# EAGLE design Pi2c (EAGLE 6.3)
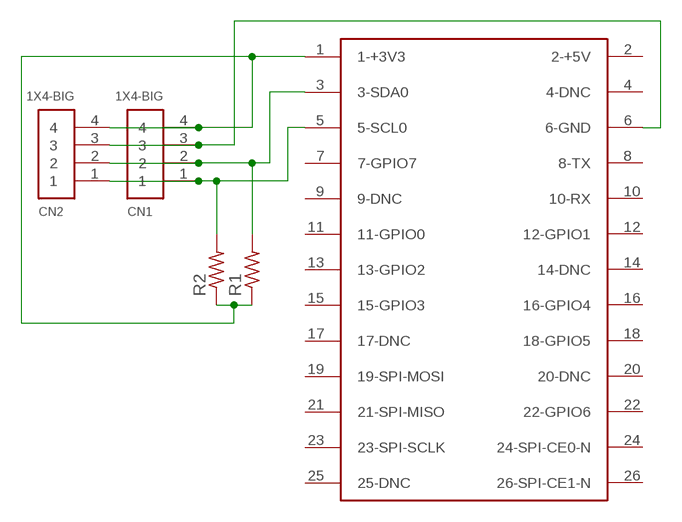
[diagram p0: schematic, sheet 1]

## Parts
CN1  1X4-BIG  [1X04-BIG]
CN2  1X4-BIG  [1X04-BIG]
R1  R-US_0207/7  [0207/7]
R2  R-US_0207/7  [0207/7]
U$1  RASPBERRY-PI  [RASPBERRY-PI]

## Nets
N$1: CN1.4 CN2.4 R1.1 R2.1 U$1.1(1-+3V3)
N$2: CN1.3 CN2.3 U$1.6(6-GND)
N$3: CN1.2 CN2.2 R1.2 U$1.3(3-SDA0)
N$4: CN1.1 CN2.1 R2.2 U$1.5(5-SCL0)
Unconnected: U$1.2(2-+5V) U$1.4(4-DNC) U$1.7(7-GPIO7) U$1.8(8-TX) U$1.9(9-DNC) U$1.10(10-RX) U$1.11(11-GPIO0) U$1.12(12-GPIO1) U$1.13(13-GPIO2) U$1.14(14-DNC) U$1.15(15-GPIO3) U$1.16(16-GPIO4) U$1.17(17-DNC) U$1.18(18-GPIO5) U$1.19(19-SPI-MOSI) U$1.20(20-DNC) U$1.21(21-SPI-MISO) U$1.22(22-GPIO6) U$1.23(23-SPI-SCLK) U$1.24(24-SPI-CE0-N) U$1.25(25-DNC) U$1.26(26-SPI-CE1-N)

## Library data of the parts
CN1 CN2 = adafruit_mod:1X4: 4-pin connector
R1 R2 = adafruit_mod:R-US_: RESISTOR, American symbol
U$1 = RaspberryPi:RASPBERRY-PI: Raspberry Pi Board <http://www.raspberrypi.org/> Jacques Lagnel V1.0 (beta) 2012 Board dimension: Forum 3D model <http://www.raspberrypi.org/forum/general-discussion/mechanical-profile-3d-models?value=3d%20model&type=1&include=1&search=1&ret=all> The GPIO Connector (P1): http://elinux.org/RPi_Low-level_peripherals

## Board
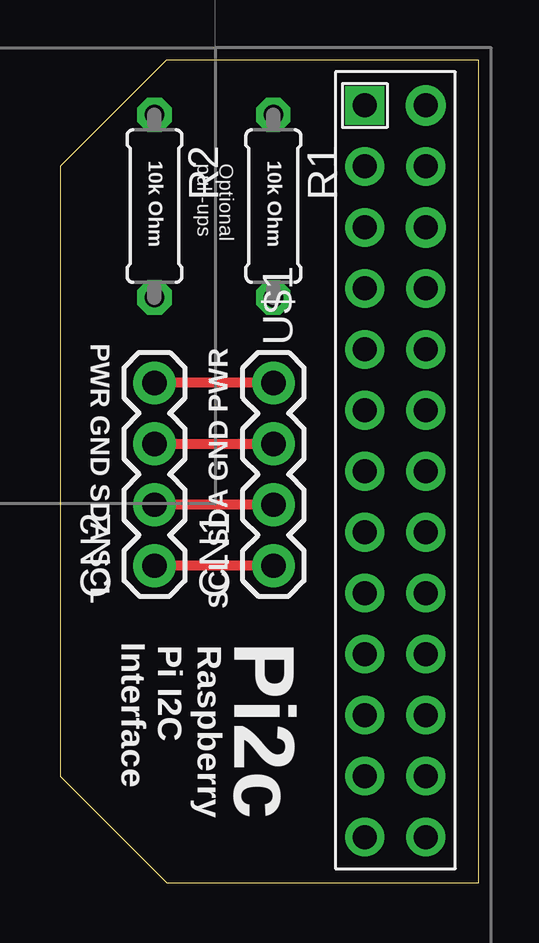
[diagram p1: board, top side]
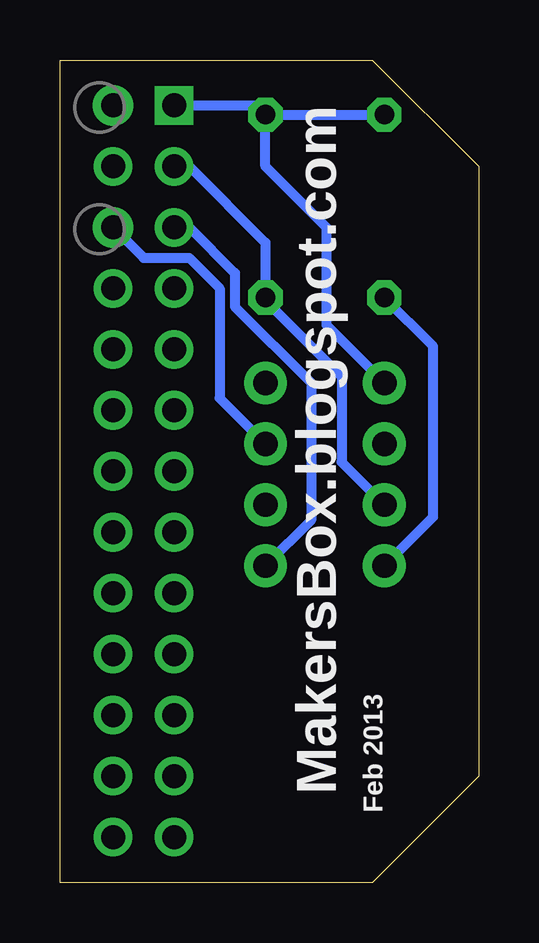
[diagram p2: board, bottom side, seen from below]

Size 17.45 x 34.28 mm. Coordinates in mm from the lower left corner, seen from the top.
Outline: 4.45,0 17.45,0 17.45,34.28 4.44,34.28 0,29.84 0,4.45 4.45,0
Copper layers (1*16): Top 0.035mm / dielectric 1.5mm / Bottom 0.035mm
Design rules "SparkFun": minimum track width 8mil, minimum drill 20mil, track to track 8mil, track to pad 8mil, pad to pad 8mil, via to via 8mil, smd to smd 8mil, copper to edge 10mil, drill to drill 8mil, minimum pad ring 12mil, minimum via ring 10mil, stop-mask expansion 4mil, vias tented up to drill 25mil, thermal gap 10mil

### Footprints (pad centres in the part's own frame; a part is rotated, then mirrored left to right if it is on the bottom)
1X04-BIG = drill 1.016 pad 1.778: 1 0,0; 2 2.54,0; 3 5.08,0; 4 7.62,0
0207/7 = drill 0.813 octagon: 1 -3.81,0; 2 3.81,0
RASPBERRY-PI = drill 1 square: 1 0,0 | drill 1 pad 1.676: 2 0,2.54; 6 5.08,2.54 | drill 1: 3 2.54,0; 4 2.54,2.54; 5 5.08,0; 7 7.62,0; 8 7.62,2.54; 9 10.16,0; 10 10.16,2.54; 11 12.7,0; 12 12.7,2.54; 13 15.24,0; 14 15.24,2.54; 15 17.78,0; 16 17.78,2.54; 17 20.32,0; 18 20.32,2.54; 19 22.86,0; 20 22.86,2.54; 21 25.4,0; 22 25.4,2.54; 23 27.94,0; 24 27.94,2.54; 25 30.48,0; 26 30.48,2.54

### Placement (x,y rotation side)
CN1  8.89,13.21 90 top
CN2  3.94,13.21 90 top
R1  8.89,28.19 270 top
R2  3.94,28.19 270 top
U$1  12.7,32.39 270 top

### Tracks (layer width: path | path; a pad name or v marks a point on that pad's centre or on a via)
N$1
  Top 0.406: CN1.4 CN2.4
  Bottom 0.406: CN2.4 6.35,23.24 6.35,27.31 8.89,29.84 R1.1 | U$1.1 9.27,32.39 R1.1 | R1.1 R2.1
N$2
  Top 0.406: CN2.3 CN1.3
  Bottom 0.406: U$1.6 13.97,26.03 12.06,26.03 10.8,24.77 10.8,20.19 CN1.3
N$3
  Top 0.406: CN1.2 CN2.2
  Bottom 0.406: U$1.3 12.06,29.84 8.89,26.67 R1.2 8.51,23.88 5.72,21.08 5.72,17.53 CN2.2
N$4
  Top 0.406: CN1.1 CN2.1
  Bottom 0.406: U$1.5 12.06,27.31 10.16,25.4 10.16,24 6.98,20.83 6.98,15.11 CN1.1 | CN2.1 1.91,15.24 1.91,22.35 R2.2

### Text on the board
tPlace: 10k Ohm | Optional / pull-ups | 10k Ohm | PWR GND SDA SCL | SCL SDA GND PWR | Interface | Pi I2C | Raspberry | Pi2c
bPlace: MakersBox.blogspot.com | Feb 2013